# Altium schematic sheet ESPEED32_V03.SchDoc
size 409 x 282 mm; PageSetup: Record=PageOptions|CenterHorizontal=True|CenterVertical=True|PrintScale=1.01|XCorrection=1.00|YCorrection=1.00|PrintKind=1|BorderSize=5000000|LeftOffset=0|BottomOffset=0|Orientation=2|PaperLength=4200|PaperWidth=2970|Scale=100|PaperSource=7|PrintQuality=600|MediaType=1|DitherType=10|PrintScaleMode=1|PaperKind=A3 (297 x 420 mm)|PaperIndex=8
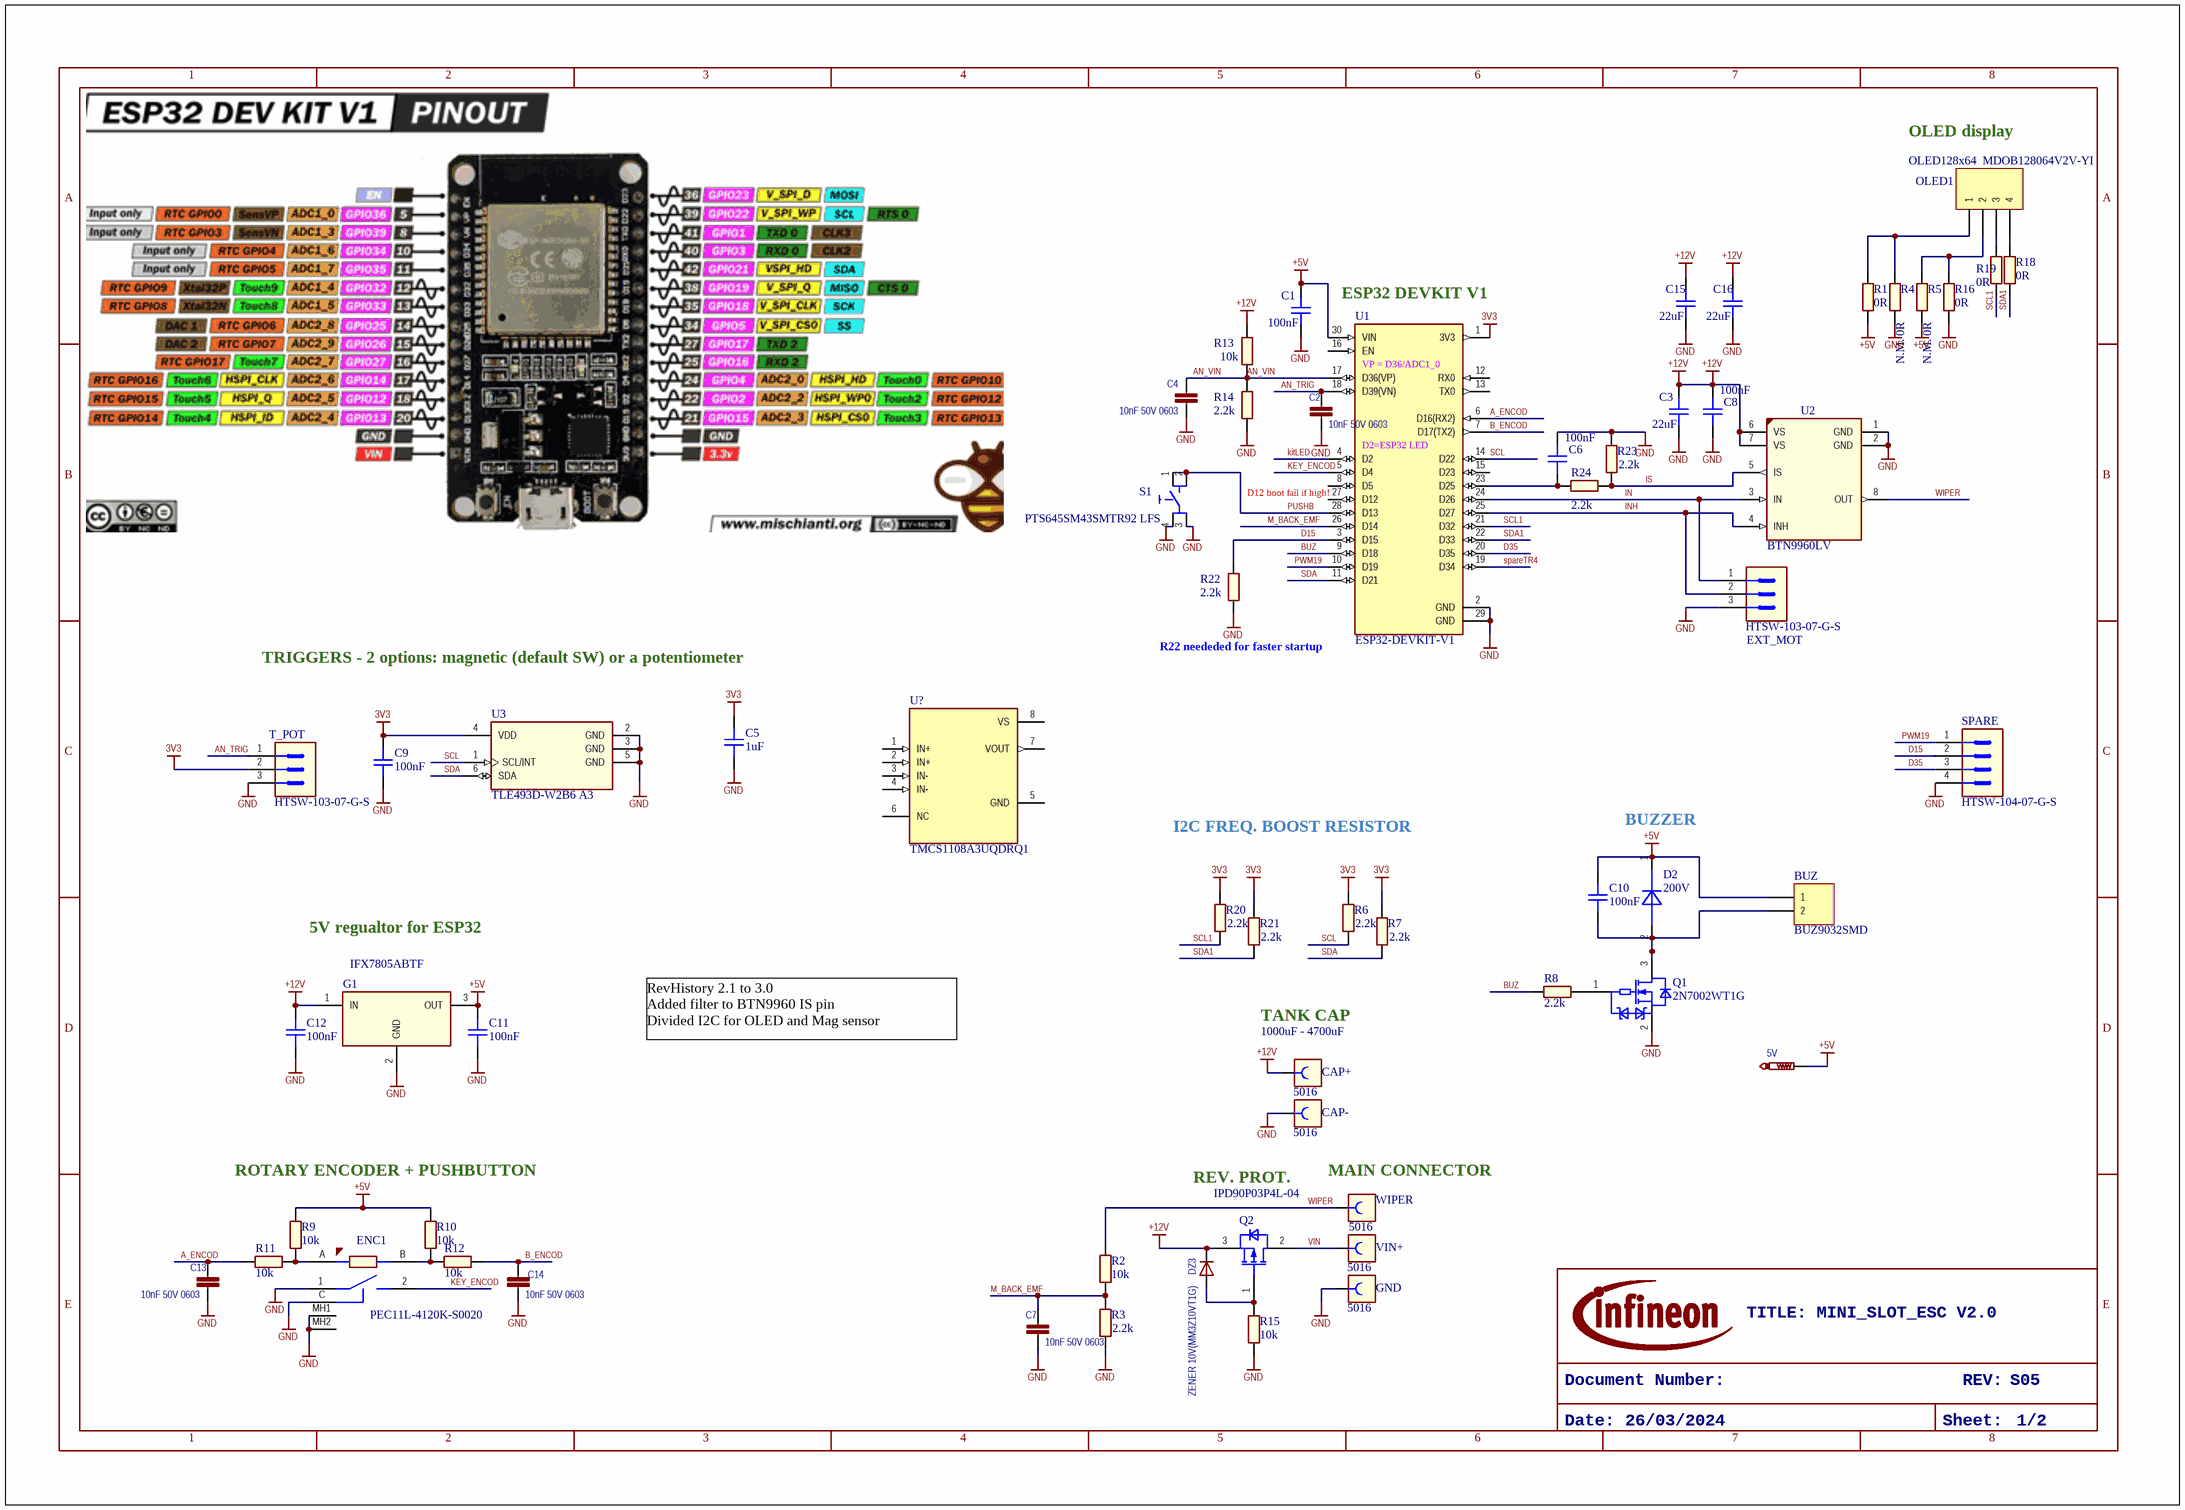
[diagram p0: ESPEED32_V03.SchDoc]

## Parts
5V  NO_POP_Mill-Max 2501-2-00-80-00-00-07-0  [TEST POINT MILL-MAX 2501-2-00-80-00-00-07-0]  (value not drawn)
BUZ  BUZ9032SMD  [BUZ9032_SMD]
C1  100nF  [C0603]
C2  10nF 50V 0603  [C0603]
C3  22uF  [CAPC3225X270N]
C4  10nF 50V 0603  [C0603]
C5  1uF  [CAPC1608X87N-1]
C6  100nF  [C0603]
C7  10nF 50V 0603  [C0603]
C8  100nF  [C0603]
C9  100nF  [C0603]
C10  100nF  [C0603]
C11  100nF  [C0603]
C12  100nF  [C0603]
C13  10nF 50V 0603  [C0603]
C14  10nF 50V 0603  [C0603]
C15  22uF  [CAPC3225X270N]
C16  22uF  [CAPC3225X270N]
CAP+  5016  [CON-SMD-TP-5016]
CAP-  5016  [CON-SMD-TP-5016]
D2  200V  [DIO-SMD-RF05VYM2SFH]
DZ3  ZENER 10V(MM3Z10VT1G)  [SOD323]
ENC1  PEC11L-4120K-S0020  [SW-THT-PEC11L-4XXXK-SXXXX]
EXT_MOT  HTSW-103-07-G-S  [CON-THT-2.54-3-1-8.38]
G1  IFX7805ABTF  [TO228P998X235-3N-2-V]
GND  5016  [CON-SMD-TP-5016]
OLED1  OLED128x64  MDOB128064V2V-YI  [OLED 128X64 1.3"]
Q1  2N7002WT1G  [SOT65P220X100-3N]
Q2  IPD90P03P4L-04  [TO228P998X235-3N-2-V]
R1  0R  [R0603]
R2  10k  [R0603]
R3  2.2k  [R0603]
R4  N.M. 0R  [R0603]
R5  N.M. 0R  [R0603]
R6  2.2k  [R0603]
R7  2.2k  [R0603]
R8  2.2k  [R0603]
R9  10k  [R0603]
R10  10k  [R0603]
R11  10k  [R0603]
R12  10k  [R0603]
R13  10k  [R0603]
R14  2.2k  [R0603]
R15  10k  [R0603]
R16  0R  [R0603]
R18  0R  [R0603]
R19  0R  [R0603]
R20  2.2k  [R0603]
R21  2.2k  [R0603]
R22  2.2k  [R0603]
R23  2.2k  [R0603]
R24  2.2k  [R0603]
S1  PTS645SM43SMTR92 LFS  [SW-SMD-PTS645SK43SMTR92]
SPARE  HTSW-104-07-G-S  [HDRV4W64P254_1X4_1016X248X838B]
T_POT  HTSW-103-07-G-S  [CON-THT-2.54-3-1-8.38]
U1  ESP32-DEVKIT-V1  [MODULE_ESP32_DEVKIT_V1]
U2  BTN9960LV  [IFX-PG-HSOF-7-1-V]
U3  TLE493D-W2B6 A3  [SOP95P280X110-6N-V]
U?  TMCS1108A3UQDRQ1  [SOIC127P599X175-8N]
VIN+  5016  [CON-SMD-TP-5016]
WIPER  5016  [CON-SMD-TP-5016]

## Nets
3V3: C5.2 C9.2 R6.2 R7.2 R20.2 R21.2 T_POT.2 U1.1(3V3) U3.4(VDD)
+5V: 5V.1(TP) BUZ.1 C1.2 C10.2 C11.2 D2.1(Cathode) G1.3(OUT) R1.1 R5.1 R9.2 R10.2 U1.30(VIN)
+12V: C3.2 C8.2 C12.2 C15.2 C16.2 CAP+.1 DZ3.K G1.1(IN) Q2.3(SOURCE) R13.2 U2.6(VS) U2.7(VS)
GND: C1.1 C2.1 C3.1 C4.1 C5.1 C6.2 C7.1 C8.1 C9.1 C11.1 C12.1 C13.1 C14.1 C15.1 C16.1 CAP-.1 ENC1.1 ENC1.C ENC1.MH1 ENC1.MH2 EXT_MOT.3 G1.2(GND) GND.1 Q1.2(S) R3.1 R4.1 R14.1 R15.1 R16.1 R22.1 R23.1 S1.3 S1.4 SPARE.4 T_POT.3 U1.2(GND) U1.29(GND) U2.1(GND) U2.2(GND) U3.2(GND) U3.3(GND) U3.5(GND)
A_ENCOD: C13.2 R11.2 U1.6(D16(RX2))
AN_TRIG: C2.2 T_POT.1 U1.18(D39(VN))
AN_VIN: C4.2 R13.1 R14.2 U1.17(D36(VP))
B_ENCOD: C14.2 R12.1 U1.7(D17(TX2))
BUZ: R8.2 U1.9(D18)
D15: R22.2 SPARE.2 U1.3(D15)
D35: SPARE.3 U1.20(D35)
IN: EXT_MOT.1 U1.24(D26) U2.3(IN)
INH: EXT_MOT.2 U1.25(D27) U2.4(INH)
IS: R23.2 R24.2 U2.5(IS)
KEY_ENCOD: ENC1.2 U1.5(D4)
kitLED: U1.4(D2)
M_BACK_EMF: C7.2 R2.1 R3.2 U1.26(D14)
PUSHB: S1.1 S1.2 U1.28(D13)
PWM19: SPARE.1 U1.10(D19)
SCL: R6.1 U1.14(D22) U3.1(SCL/INT)
SCL1: R19.1 R20.1 U1.21(D32)
SDA: R7.1 U1.11(D21) U3.6(SDA)
SDA1: R18.1 R21.1 U1.22(D33)
spareTR4: U1.19(D34)
VIN: Q2.2(DRAIN) VIN+.1
WIPER: R2.2 U2.8(OUT) WIPER.1
NetBUZ_2: BUZ.2 C10.1 D2.2(Anode) Q1.3(D)
NetC6_1: C6.1 R24.1 U1.23(D25)
NetDZ3_A: DZ3.A Q2.1(GATE) R15.2
NetENC1_A: ENC1.A R9.1 R11.1
NetENC1_B: ENC1.B R10.1 R12.2
NetOLED1_1: OLED1.1 R1.2 R4.2
NetOLED1_2: OLED1.2 R5.2 R16.2
NetOLED1_3: OLED1.3 R19.2
NetOLED1_4: OLED1.4 R18.2
NetQ1_1: Q1.1(G) R8.1

Not connected (* = marked no-connect by the designer): U1 8(D5) 12(RX0) 13(TX0) 15(D23) 16(EN) 27(D12); U? 1(IN+) 2(IN+) 3(IN-) 4(IN-) 5(GND) 6(NC) 7(VOUT) 8(VS)

## Notes on the sheet
- Remarks: if not specified differently
- OLED display
- ESP32 DEVKIT V1
- (near U1) VP = D36/ADC1_0
- (near U1) D2=ESP32 LED
- (near U1) D12 boot fail if high!
- (near U1) R22 neededed for faster startup
- TRIGGERS - 2 options: magnetic (default SW) or a potentiometer
- I2C FREQ. BOOST RESISTOR
- BUZZER
- 5V regualtor for ESP32
- RevHistory 2.1 to 3.0
  Added filter to BTN9960 IS pin
  Divided I2C for OLED and Mag sensor
- TANK CAP
- (near CAP+) 1000uF - 4700uF
- ROTARY ENCODER + PUSHBUTTON
- REV. PROT.
- (near WIPER) MAIN CONNECTOR
- TITLE: MINI_SLOT_ESC V2.0
- Document Number:
- REV:
- S05
- Date:
- 26/03/2024
- Sheet:
- 1/2
- 1
- 2
- 3
- 4
- 5
- 6
- 7
- 8
- A
- B
- C
- D
- E

## Library data of the parts
5V = TESTPAD_1MM: testpad 1mm diameter; JLC: *
BUZ = Header 2: Header, 2-Pin; LatestRevisionDate: 17-Jul-2002; LatestRevisionNote: Re-released for DXP Platform.; Publisher: Altium Limited; JLC: *
C1 C6 C8-C12 = 298841: CAP / CERA / 100nF / 25V / 10% / X8R (EIA) / -55°C to 150°C / 0603(1608) / SMD / -; Multiple Parts: No; Legacy PartNumber: CAP01008841; Manufacturer: MuRata; Manufacturer Order Number: GCM188R91E104KA37; Symbol Type: Capacitor; Single; Standard; 2 Pins; Alternate View: Yes; Article Number: 298841; Version Number: V01; Combined Parameters: TC:X8R (EIA);Tol.:-10%/+10%;Vdc:25V; QuickPick: 100nF / 25V / 10% / X8R (EIA) / 0603 (1608); Type: Standard; Style: Single; Automotive Qualified: AEC Q200; Package Metric: 1608; Package Imperial: 0603; ComponentStatus: Released; PLMStatus: Active; Legacy DeviceID: CAP01008841; Part Type: Capacitor; Value: 100nF; Tolerance Neg: 10%; Tolerance Pos: 10%; Application: Standard; Technology: Ceramic; Temperature min: -55; Temperature max: 150; Temperature Range: Military; ROHS Compliant: Y; PackageReference: 0603 (1608); ComponentLink1Description: Vendor WebSite; ComponentLink1URL: http://www.murata.com/; ComponentLink2Description: Datasheet; ComponentLink2URL: http://webnetprod.muc.infineon.com/PCBPortal_Prod/WorkFlows/AltiumComponent/StandardDocumentation?Versionid=298842; Supplier 1: Farnell; Supplier 2: DigiKey; Supplier 3: Mouser; Second Source allowed: Yes; Voltage DC (max): 25V; Package Description: Capacitor,non-polarized,Chip;1.60mm L X 0.80mm W X 0.90mm H
C2 C4 C7 C13 C14 = C-EUC0402: CAPACITOR, European symbol; JLC: *
C3 C15 C16 = 284084: CAP / CERA / 22uF / 25V / 20% / X5R (EIA) / -55°C to 85°C / 1210(3225) / SMD / -; Multiple Parts: No; Legacy PartNumber: CAP01005898; Manufacturer: MuRata; Manufacturer Order Number: GRM32ER61E226ME15; Symbol Type: Capacitor; Single; Standard; 2 Pins; Alternate View: Yes; Article Number: 284084; Version Number: V01; Combined Parameters: TC:X5R (EIA);Tol.:-20%/+20%;Vdc:25V; QuickPick: 22uF / 25V / 20% / X5R (EIA) / 1210 (3225); Type: Standard; Style: Single; Package Metric: 3225; Package Imperial: 1210; ComponentStatus: Released; PLMStatus: Not Recommended For New Designs; Legacy DeviceID: CAP01005898; Part Type: Capacitor; Value: 22uF; Tolerance Neg: 20%; Tolerance Pos: 20%; Application: Standard; Technology: Ceramic; Temperature min: -55; Temperature max: 85; Temperature Range: Military; ROHS Compliant: Y; Automotive Qualified: No; PackageReference: 1210 (3225); ComponentLink1Description: Vendor WebSite; ComponentLink1URL: http://www.murata.com/; ComponentLink2Description: Datasheet; ComponentLink2URL: http://webnetprod.muc.infineon.com/PCBPortal_Prod/WorkFlows/AltiumComponent/StandardDocumentation?Versionid=284085; Supplier 1: Farnell; Supplier 2: DigiKey; Supplier 3: Mouser; Second Source allowed: Yes; Voltage DC (max): 25V; Package Description: Capacitor,non-polarized,Chip;3.20mm L X 2.50mm W X 2.70mm H
C5 = 633630: CAP / CERA / 1uF / 25V / 20% / X5R (EIA) / -55°C to 85°C / 0603(1608) / SMD / -; Multiple Parts: No; Manufacturer: Wurth Elektronik; Manufacturer Order Number: 885012106022; Symbol Type: Capacitor; Single; Standard; 2 Pins; Alternate View: Yes; Article Number: 633630; Version Number: V01; Combined Parameters: TC:X5R (EIA);Tol.:-20%/+20%;Vdc:25V; QuickPick: 1uF / 25V / 20% / X5R (EIA) / 0603 (1608); Type: Standard; Style: Single; Package Metric: 1608; Package Imperial: 0603; ComponentStatus: Released; PLMStatus: Active; Part Type: Capacitor; Value: 1uF; Tolerance Neg: 20%; Tolerance Pos: 20%; Application: Standard; Technology: Ceramic; Temperature min: -55; Temperature max: 85; Temperature Range: Military; ROHS Compliant: Y; Automotive Qualified: No; PackageReference: 0603 (1608); ComponentLink1Description: Vendor WebSite; ComponentLink1URL: http://www.we-online.com; ComponentLink2Description: Datasheet; ComponentLink2URL: http://webnetprod.muc.infineon.com/PCBPortal_Prod/WorkFlows/AltiumComponent/StandardDocumentation?Versionid=633631; Supplier 1: Farnell; Supplier Part Number 1: 2495150; Supplier 2: DigiKey; Supplier Part Number 2: 732-7919-2-ND; Supplier 3: Mouser; Supplier Part Number 3: 710-885012106022; Second Source allowed: Yes; Voltage DC (max): 25V; Package Description: Capacitor,non-polarized,Chip;1.60mm L X 0.80mm W X 0.87mm H
CAP+ CAP- GND VIN+ WIPER = 387523: Test Point, Compact, Surface Mount, Finish- Silver Plate; Multiple Parts: No; Legacy PartNumber: CON01501019; Manufacturer: Keystone Electronics Corp.; Symbol Type: Connector, 1 Lead, Female; Alternate View: Yes; Article Number: 387523; Version Number: V01; Legacy DeviceID: KEY_5016; Combined Parameters: Board-to-Cable None (onboard);1x1;Mounting:SMT;Orient:None (onboard);Shielded:No; QuickPick: None (onboard) / Board-to-Cable; Style: Not Applicable; ComponentStatus: Released; PLMStatus: Active; Voltage DC (max): na; Part Type: Connector; Manufacturer Order Number: 5016; Value: 5016; Type: Board-to-Cable; Application: Test; Temperature min: 0; Temperature max: 0; Temperature Range: Military; ROHS Compliant: Y; Automotive Qualified: No; ComponentLink1Description: Vendor WebSite; ComponentLink1URL: http://www.keyelco.com/; ComponentLink2Description: Datasheet; ComponentLink2URL: http://webnetprod.muc.infineon.com/PCBPortal_Prod/WorkFlows/AltiumComponent/StandardDocumentation?Versionid=387524; Supplier 1: Farnell; Supplier Part Number 1: 2292858; Supplier 2: DigiKey; Supplier Part Number 2: 36-5016CT-ND; Supplier 3: Mouser; Supplier Part Number 3: 534-5016; Second Source allowed: Yes; Package Description: Test Point, SMD, 3.81mm L X 2.84mm W X 2.44mm H body
D2 = 689842: Super Fast Recovery Diode; Manufacturer: ROHM Semiconductors; Manufacturer Order Number: RF05VAM2STR; Symbol Type: Standard Diode Symbol, 2 Leads, 1 Cathode, 2 Anode; Article Number: 689842; Version Number: V00; Combined Parameters: Vf:980mV;If:-;Ur:200V;Ir:10uA;Pmax:-; QuickPick: Standard Diode / SMD; Type: Standard Diode; Style: Single; Automotive Qualified: No; ComponentStatus: Released; PLMStatus: Active; Second Source allowed: Yes; Voltage DC (max): na; Part Type: Diode; Value: 200V; Application: Switching; Temperature min: -55; Temperature max: 150; Temperature Range: Military; ROHS Compliant: Y; PackageReference: SMD; ComponentLink1Description: Vendor WebSite; ComponentLink1URL: http://www.rohm.com; ComponentLink2Description: Datasheet; ComponentLink2URL: http://webnetprod.muc.infineon.com/PCBPortal_Prod/WorkFlows/AltiumComponent/StandardDocumentation?Versionid=689843; Supplier 1: Farnell; Supplier Part Number 1: 2924740; Supplier 2: DigiKey; Supplier Part Number 2: RF05VAM2SCT-ND; Supplier 3: Mouser; Supplier Part Number 3: 755-RF05VAM2STR; Package Description: Diode, SMD, 2 pin, 2.00 mm L X 1.40 mm W X 0.80 mm H body
DZ3 = NXP_BAT46WJ: Zener 10V MM3Z10VST1G
ENC1 = 633536: 11 mm Low Profile Encoder; Multiple Parts: No; Manufacturer: Bourns; Alternate View: Yes; Symbol Type: Low Profile Encoder SPST Switch; Article Number: 633536; Version Number: V01; Legacy DeviceID: BOURNS_PEC11L-4120K-S0020; Combined Parameters: Res.:-;Fmax:-; QuickPick: Switch / THT; ComponentStatus: Released; PLMStatus: Active; Voltage DC (max): na; Part Type: Analog Parts; Manufacturer Order Number: PEC11L-4120K-S0020; Value: PEC11L-4120K-S0020; Type: Switch; Application: Power Electronics; Temperature min: -25; Temperature max: 80; Temperature Range: Commercial; ROHS Compliant: Y; Automotive Qualified: No; PackageReference: THT; ComponentLink1Description: Vendor WebSite; ComponentLink1URL: http://www.bourns.com; ComponentLink2Description: Datasheet; ComponentLink2URL: http://webnetprod.muc.infineon.com/PCBPortal_Prod/WorkFlows/AltiumComponent/StandardDocumentation?Versionid=633537; Supplier 1: Farnell; Supplier 2: DigiKey; Supplier Part Number 2: 118-PEC11L-4120K-S0020-ND; Supplier 3: Mouser; Supplier Part Number 3: 652-PEC11L4120KS0020; Second Source allowed: Yes; Package Description: Switch, THT, 2.50 mm Pitch, 5 Pins, 13.20 mm L X 12.00 mm W X 25.0 mm H body
EXT_MOT T_POT = 375892: Through hole .025 SQ Post Header, 2.54mm pitch, 3 pin, vertical, single row; Legacy PartNumber: CON00000054; Manufacturer: Samtec; Article Number: 375892; Version Number: V01; Legacy DeviceID: SAM_HTSW-103-07-G-S; Combined Parameters: Board-to-Board Header (male);3x1;Mounting:THT;Orient:0° (vertical);Shielded:No; QuickPick: 0° (vertical) / Board-to-Board; Style: Strip; Automotive Qualified: No; ComponentStatus: Released; PLMStatus: Active; Second Source allowed: Yes; Voltage DC (max): na; Part Type: Connector; Manufacturer Order Number: HTSW-103-07-G-S; Value: HTSW-103-07-G-S; Type: Board-to-Board; Temperature min: -55; Temperature max: 125; Temperature Range: Military; ROHS Compliant: Y; ComponentLink1Description: Vendor WebSite; ComponentLink1URL: http://www.samtec.com/; ComponentLink2Description: Datasheet; ComponentLink2URL: http://webnetprod.muc.infineon.com/PCBPortal_Prod/WorkFlows/AltiumComponent/StandardDocumentation?Versionid=375893; Supplier 1: Farnell; Supplier Part Number 1: 1925743; Supplier 2: DigiKey; Supplier Part Number 2: SAM8814-ND; Supplier 3: Mouser; Package Description: Header,vertical,2.54mm pitch;0.64mm lead width,3 pins,1 row,3 pins per row,7.62mm L X 2.48mm W X 8.38mm H body
G1 = 428687: Three Terminal 1.0A Positive Voltage Regulator; Legacy PartNumber: IFX01400731; Manufacturer: Infineon Technologies; Alternate View: No; Article Number: 428687; Version Number: V01; Legacy DeviceID: IFX_IFX7805ABTF; Combined Parameters: Linear Not applicable -;Vo:5V to 5V; QuickPick: Linear / PG-TO252-3-11; Style: Not applicable; ComponentStatus: Released; PLMStatus: Obsolete; Second Source allowed: Yes; Voltage DC (max): na; Symbol Type: Three Terminal 1.0A Positive Voltage Regulator; Multiple Parts: No; Part Type: Power Supply; Manufacturer Order Number: IFX7805ABTF; Value: IFX7805ABTF; Type: Linear; Temperature min: -40; Temperature max: 125; Temperature Range: Automotive; ROHS Compliant: Y; Automotive Qualified: No; PackageReference: PG-TO252-3-11; ComponentLink1Description: Vendor WebSite; ComponentLink1URL: https://www.infineon.com/; ComponentLink2Description: Datasheet; ComponentLink2URL: http://webnetprod.muc.infineon.com/PCBPortal_Prod/WorkFlows/AltiumComponent/StandardDocumentation?Versionid=428688; Supplier 1: Farnell; Supplier Part Number 1: 2762330; Supplier 2: DigiKey; Supplier Part Number 2: IFX7805ABTFATMA1TR-ND; Supplier 3: Mouser; Supplier Part Number 3: 726-IFX7805ABTFATMA1; Package Description: TO,2.28mm pitch;2 pin,9.98mm L X 6.12mm W X 2.35mm H body
OLED1 = Header 4: Header, 4-Pin; LatestRevisionDate: 17-Jul-2002; LatestRevisionNote: Re-released for DXP Platform.; Publisher: Altium Limited; JLC: *
Q1 = 836576: Insulated-Gate Field-Effect Transistor (IGFET), N-Channel, Enhancement,  Body Diode, Resistor Gate, ESD Diode Gate/Source, Pin 1 Gate, 2 Source, 3 Drain, 3 Pins; Multiple Parts: No; Manufacturer: ON Semiconductor; Article Number: 836576; Version Number: V00; Legacy DeviceID: ON_2N7002WT1G; Combined Parameters: N-Channel Enhancement;Uds:60V;Id:340mA;Rds:1.6R;P:280mW; QuickPick: N-Channel Enhancement / 280mW / 340mA / 60V / SOT323 (SC-70); Type: N-Channel Enhancement; Style: Single; ComponentStatus: Released; PLMStatus: Active; Second Source allowed: Yes; Voltage DC (max): na; Symbol Type: Insulated-Gate Field-Effect Transistor (IGFET), N-Channel, Enhancement,  Body Diode, Resistor Gate, ESD Diode Gate/Source, Pin 1 Gate, 2 Source, 3 Drain, 3 Pins; Alternate View: No; Part Type: Transistor FET; Manufacturer Order Number: 2N7002WT1G; Value: 2N7002WT1G; Application: Small Signal; Temperature min: -55; Temperature max: 150; Temperature Range: Military; ROHS Compliant: Y; Automotive Qualified: No; PackageReference: SOT323 (SC-70); ComponentLink1Description: Vendor WebSite; ComponentLink1URL: http://onsemi.com/; ComponentLink2Description: Datasheet; ComponentLink2URL: http://webnetprod.muc.infineon.com/PCBPortal_Prod/WorkFlows/AltiumComponent/StandardDocumentation?Versionid=836577; Supplier 1: Farnell; Supplier Part Number 1: 2533171; Supplier 2: DigiKey; Supplier Part Number 2: 2N7002WT1GOSCT-ND; Supplier 3: Mouser; Supplier Part Number 3: 863-2N7002WT1G; Package Description: SOT,0.65mm,pitch;3 pin,1.25mm W X 2.00mm L X 1.00mm H body
Q2 = 418791: OptiMOS - P2 Power-Transistor, P-channel-Enhancement mode, VDS -30V; Legacy PartNumber: IFX00200003; Manufacturer: Infineon Technologies; Symbol Type: Insulated-Gate Field-Effect Transistor (IGFET), P-Channel, Enhancement,  Body Diode, Pin 1 Gate, 2 Drain, 3 Source, 3 Pins; Article Number: 418791; Version Number: V01; Legacy DeviceID: IFX_IPD90P03P4L-04; Combined Parameters: P-Channel Enhancement;Uds:-30V;Id:-90A;Rds:4.5mR;P:137W; QuickPick: P-Channel Enhancement / 137W / -90A / -30V / PG-TO252-3-11; Type: P-Channel Enhancement; Style: Single; Automotive Qualified: Yes; ComponentStatus: Released; PLMStatus: Active; Voltage DC (max): na; Part Type: Transistor FET; Manufacturer Order Number: IPD90P03P4L-04; Value: IPD90P03P4L-04; Application: Switching; Temperature min: -55; Temperature max: 175; Temperature Range: Military; ROHS Compliant: Y; PackageReference: PG-TO252-3-11; ComponentLink1Description: Vendor WebSite; ComponentLink1URL: https://www.infineon.com/; ComponentLink2Description: Datasheet; ComponentLink2URL: http://webnetprod.muc.infineon.com/PCBPortal_Prod/WorkFlows/AltiumComponent/StandardDocumentation?Versionid=418792; Supplier 1: Farnell; Supplier Part Number 1: 2432731RL; Supplier 2: DigiKey; Supplier Part Number 2: IPD90P03P4L04ATMA1CT-ND; Supplier 3: Mouser; Supplier Part Number 3: 726-IPD90P03P4L04ATM; Second Source allowed: Yes; Package Description: TO,2.28mm pitch;2 pin,9.98mm L X 6.12mm W X 2.35mm H body
R1 R4 R5 R16 R18 R19 = 328011: General Purpose Chip Resistor; Multiple Parts: No; Legacy PartNumber: RES00000126; Manufacturer: Yageo; Manufacturer Order Number: RC0603JR-070RL; Manufacturer Component Status: Active; Symbol Type: Resistor; Single; Standard; 2 Pins; Alternate View: Yes; Version Number: V01; Combined Parameters: TCR:0ppm/K;Tol.:-0R/+0R;Vdc:75V;Idc:1A;P:100mW; Style: Single; Voltage DC (max): 75V; Article Number: 328011; Legacy DeviceID: RES00000126; Part Type: Resistor; Value: 0R; Tolerance Neg: 0R; Tolerance Pos: 0R; Type: Standard; Technology: Thick Film; Temperature min: -55; Temperature max: 155; Temperature Range: Military; RoHS Compliant: Y; Automotive Qualified: No; PackageReference: 0603; ComponentLink1Description: Vendor WebSite; ComponentLink1URL: http://www.yageo.com/; ComponentLink2Description: Datasheet; ComponentLink2URL: http://webnetprod.muc.infineon.com/pcbportal_prod/WorkFlows/AltiumComponent/StandardDocumentation?Versionid=328012; Supplier 1: Farnell; Supplier Part Number 1: 9233130; Supplier 2: DigiKey; Supplier Part Number 2: 311-0.0GRTR-ND; Supplier 3: Mouser; Supplier Part Number 3: 603-RC0603JR-070RL; PLMStatus: Active; Second Source allowed: Yes
R2 R9-R13 R15 = 370605: RES / STD / 10k / 100mW / 5% / 100ppm/K / -55°C to 155°C / 0603(1608) / SMD / -; Multiple Parts: No; Legacy PartNumber: RES01805989; Manufacturer: Yageo; Manufacturer Order Number: RC0603JR-0710KL; Symbol Type: Resistor; Single; Standard; 2 Pins; Alternate View: Yes; Article Number: 370605; Version Number: V01; Combined Parameters: TCR:100ppm/K;Tol.:-5%/+5%;Vdc:50V;Idc:-;P:100mW; QuickPick: 10k / 5% / 0.1 / 0603 (1608); Style: Single; Package Metric: 1608; Package Imperial: 0603; ComponentStatus: Released; PLMStatus: Active; Voltage DC (max): 50V; Legacy DeviceID: RES01805989; Part Type: Resistor; Value: 10k; Tolerance Neg: 5%; Tolerance Pos: 5%; Type: Standard; Technology: Thick Film; Temperature min: -55; Temperature max: 155; Temperature Range: Military; ROHS Compliant: Y; Automotive Qualified: No; PackageReference: 0603 (1608); ComponentLink1Description: Vendor WebSite; ComponentLink1URL: http://www.yageo.com/; ComponentLink2Description: Datasheet; ComponentLink2URL: http://webnetprod.muc.infineon.com/PCBPortal_Prod/WorkFlows/AltiumComponent/StandardDocumentation?Versionid=370606; Supplier 1: Farnell; Supplier Part Number 1: 2363484; Supplier 2: DigiKey; Supplier Part Number 2: 311-10KGRTR-ND; Supplier 3: Mouser; Supplier Part Number 3: 603-RC0603JR-0710KL; Second Source allowed: Yes
R3 R6-R8 R14 R20-R24 = 327846: RES / STD / 2.2k / 100mW / 1% / 100ppm/K / -55°C to 155°C / 0603(1608) / SMD / -; Multiple Parts: No; Legacy PartNumber: RES00000093; Manufacturer: Yageo; Manufacturer Order Number: RC0603FR-072K2L; Symbol Type: Resistor; Single; Standard; 2 Pins; Alternate View: Yes; Article Number: 327846; Version Number: V01; Combined Parameters: TCR:100ppm/K;Tol.:-1%/+1%;Vdc:75V;Idc:-;P:100mW; QuickPick: 2.2k / 1% / 0.1 / 0603 (1608); Style: Single; Package Metric: 1608; Package Imperial: 0603; ComponentStatus: Released; PLMStatus: Active; Voltage DC (max): 75V; Legacy DeviceID: RES00000093; Part Type: Resistor; Value: 2.2k; Tolerance Neg: 1%; Tolerance Pos: 1%; Type: Standard; Technology: Thick Film; Temperature min: -55; Temperature max: 155; Temperature Range: Military; ROHS Compliant: Y; Automotive Qualified: No; PackageReference: 0603 (1608); ComponentLink1Description: Vendor WebSite; ComponentLink1URL: http://www.yageo.com/; ComponentLink2Description: Datasheet; ComponentLink2URL: http://webnetprod.muc.infineon.com/PCBPortal_Prod/WorkFlows/AltiumComponent/StandardDocumentation?Versionid=327847; Supplier 1: Farnell; Supplier Part Number 1: 9238522; Supplier 2: DigiKey; Supplier Part Number 2: 311-2.20KHRTR-ND; Supplier 3: Mouser; Supplier Part Number 3: 603-RC0603FR-072K2L; Second Source allowed: Yes
S1 = 726674: Tact Switches, Variety of Actuator Lengths; Manufacturer: C&K; Article Number: 726674; Version Number: V01; Automotive Qualified: No; ComponentStatus: Released; PLMStatus: Active; Second Source allowed: Yes; Voltage DC (max): na; Part Type: Electro Mechanic; Manufacturer Order Number: PTS645SM43SMTR92 LFS; Value: PTS645SM43SMTR92 LFS; Application: Switching; Temperature min: -40; Temperature max: 85; Temperature Range: Industrial; ROHS Compliant: Y; PackageReference: SMD; ComponentLink1Description: Vendor WebSite; ComponentLink1URL: http://www.ck-components.com; ComponentLink2Description: Datasheet; ComponentLink2URL: http://webnetprod.muc.infineon.com/PCBPortal_Prod/WorkFlows/AltiumComponent/StandardDocumentation?Versionid=726675; Supplier 1: Farnell; Supplier Part Number 1: 3941596; Supplier 2: DigiKey; Supplier Part Number 2: CKN9112CT-ND; Supplier 3: Mouser; Supplier Part Number 3: 611-PTS645SM43SMTR92; Package Description: Switch, SMD, 4 pin, 6.00 mm L X 6.00 mm W X 4.40 mm H body
SPARE = 379652: Through hole .025 SQ Post Header, Hi-Temp Strip, 2.54mm pitch, 4 pin, vertical, single row; Legacy PartNumber: CON01500246; Manufacturer: Samtec; Article Number: 379652; Version Number: V01; Legacy DeviceID: SAM_HTSW-104-07-G-S; Combined Parameters: Board-to-Board/Cable Header (male);4x1;Mounting:THT;Orient:0° (vertical);Shielded:No; QuickPick: 0° (vertical) / Board-to-Board/Cable; Automotive Qualified: No; ComponentStatus: Released; PLMStatus: Active; Second Source allowed: Yes; Voltage DC (max): na; Part Type: Connector; Manufacturer Order Number: HTSW-104-07-G-S; Value: HTSW-104-07-G-S; Type: Board-to-Board/Cable; Style: Strip; Temperature min: -55; Temperature max: 125; Temperature Range: Military; ROHS Compliant: Y; PackageReference: THT; ComponentLink1Description: Vendor WebSite; ComponentLink1URL: http://www.samtec.com/; ComponentLink2Description: Datasheet; ComponentLink2URL: http://webnetprod.muc.infineon.com/PCBPortal_Prod/WorkFlows/AltiumComponent/StandardDocumentation?Versionid=379653; Supplier 1: Farnell; Supplier Part Number 1: 1926031; Supplier 2: DigiKey; Supplier Part Number 2: SAM9526-ND; Supplier 3: Mouser; Package Description: Header,vertical,2.54mm pitch;0.64mm lead width,4 pins,1 row,4 pins per row,10.16mm L X 2.48mm W X 8.38mm H body
U1 = ESP32-DEVKIT-V1: Dual core, Wi-Fi: 2.4 GHz up to 150 Mbits/s,BLE (Bluetooth Low Energy) and legacy Bluetooth, 32 bits, Up to 240 MHz; MF: Do it; Price: None; Availability: Not in stock; Package: None; MP: ESP32-DEVKIT-V1; Value: *; SnapEDA_Link: https://www.snapeda.com/parts/ESP32-DEVKIT-V1/Do+it/view-part/?ref=snap; Check_prices: https://www.snapeda.com/parts/ESP32-DEVKIT-V1/Do+it/view-part/?ref=eda
U2 = 841588: MOTIX Single Half-Bridge with Integrated Driver IC; Multiple Parts: No; Manufacturer: Infineon Technologies; Symbole Type: High Current PN Half-Bridge with Integrated Driver; Alternate View: Yes; Article Number: 841588; Version Number: V00; Legacy DeviceID: IFX_BTN9960LV; Combined Parameters: Automotive Driver;Vdc min/max:8V/18V;Iout:-;Fmax:-; QuickPick: PG-HSOF-7-1; Automotive Qualified: AEC Q100; ComponentStatus: Released; PLMStatus: Active; Voltage DC (max): na; Part Type: Integrated Circuit; Manufacturer Order Number: BTN9960LV; Value: BTN9960LV; Type: Driver; Application: Automotive; Temperature min: -40; Temperature max: 150; Temperature Range: Automotive; ROHS Compliant: Y; PackageReference: PG-HSOF-7-1; ComponentLink1Description: Vendor WebSite; ComponentLink1URL: https://www.infineon.com/; ComponentLink2Description: Datasheet; ComponentLink2URL: http://webnetprod.muc.infineon.com/PCBPortal_Prod/WorkFlows/AltiumComponent/StandardDocumentation?Versionid=841589; Supplier 1: Farnell; Supplier 2: DigiKey; Supplier 3: Mouser; Supplier Part Number 3: 726-BTN9960LVAUMA1; Second Source allowed: Yes; Package Description: HSOF-7-1; SMD, 0.90 mm Pitch, 8 pin, 6.70 mm L X 7.00 mm W X 2.30 mm H body; Parameter 1: *
U3 = 492229: Low Power 3D Hall Sensor with I2C Interface and Wake Up Function, Temp Range(-40 to 125°C); Manufacturer: Infineon Technologies; Alternate View: No; Article Number: 492229; Version Number: V01; Legacy DeviceID: IFX_TLE493D-W2B6 A3; Automotive Qualified: Yes; ComponentStatus: Released; PLMStatus: Active; Voltage DC (max): na; Symbol Type: Low Power 3D Hall Sensor with I2C Interface and Wake Up Function; Multiple Parts: No; Part Type: Sensor; Manufacturer Order Number: TLE493D-W2B6 A3; Value: TLE493D-W2B6 A3; Application: Automotive; Temperature min: -40; Temperature max: 125; Temperature Range: Automotive; ROHS Compliant: Y; PackageReference: PG-TSOP6-6-8; ComponentLink1Description: Vendor WebSite; ComponentLink1URL: https://www.infineon.com/; ComponentLink2Description: Datasheet; ComponentLink2URL: http://webnetprod.muc.infineon.com/PCBPortal_Prod/WorkFlows/AltiumComponent/StandardDocumentation?Versionid=492230; Supplier 1: Farnell; Supplier 2: DigiKey; Supplier Part Number 2: TLE493DW2B6A3HTSA1CT-ND; Supplier 3: Mouser; Supplier Part Number 3: 726-TLE493DW2B6A3HTS; Second Source allowed: Yes; Package Description: SOP,0.95mm pitch;6 pin,1.60mm W X 2.90mm L X 1.10mm H body
U? = TMCS1108A3UQDRQ1: AEC-Q100, Â±100-V isolated Hall-effect current sensor with internal reference; MF: Texas Instruments; SnapEDA_Link: https://www.snapeda.com/parts/TMCS1108A3UQDRQ1/Texas+Instruments/view-part/?ref=snap; Package: None; Value: *; MP: TMCS1108A3UQDRQ1; Check_prices: https://www.snapeda.com/parts/TMCS1108A3UQDRQ1/Texas+Instruments/view-part/?ref=eda